# Altium schematic sheet PWR & Sensor Input.SchDoc
size A4
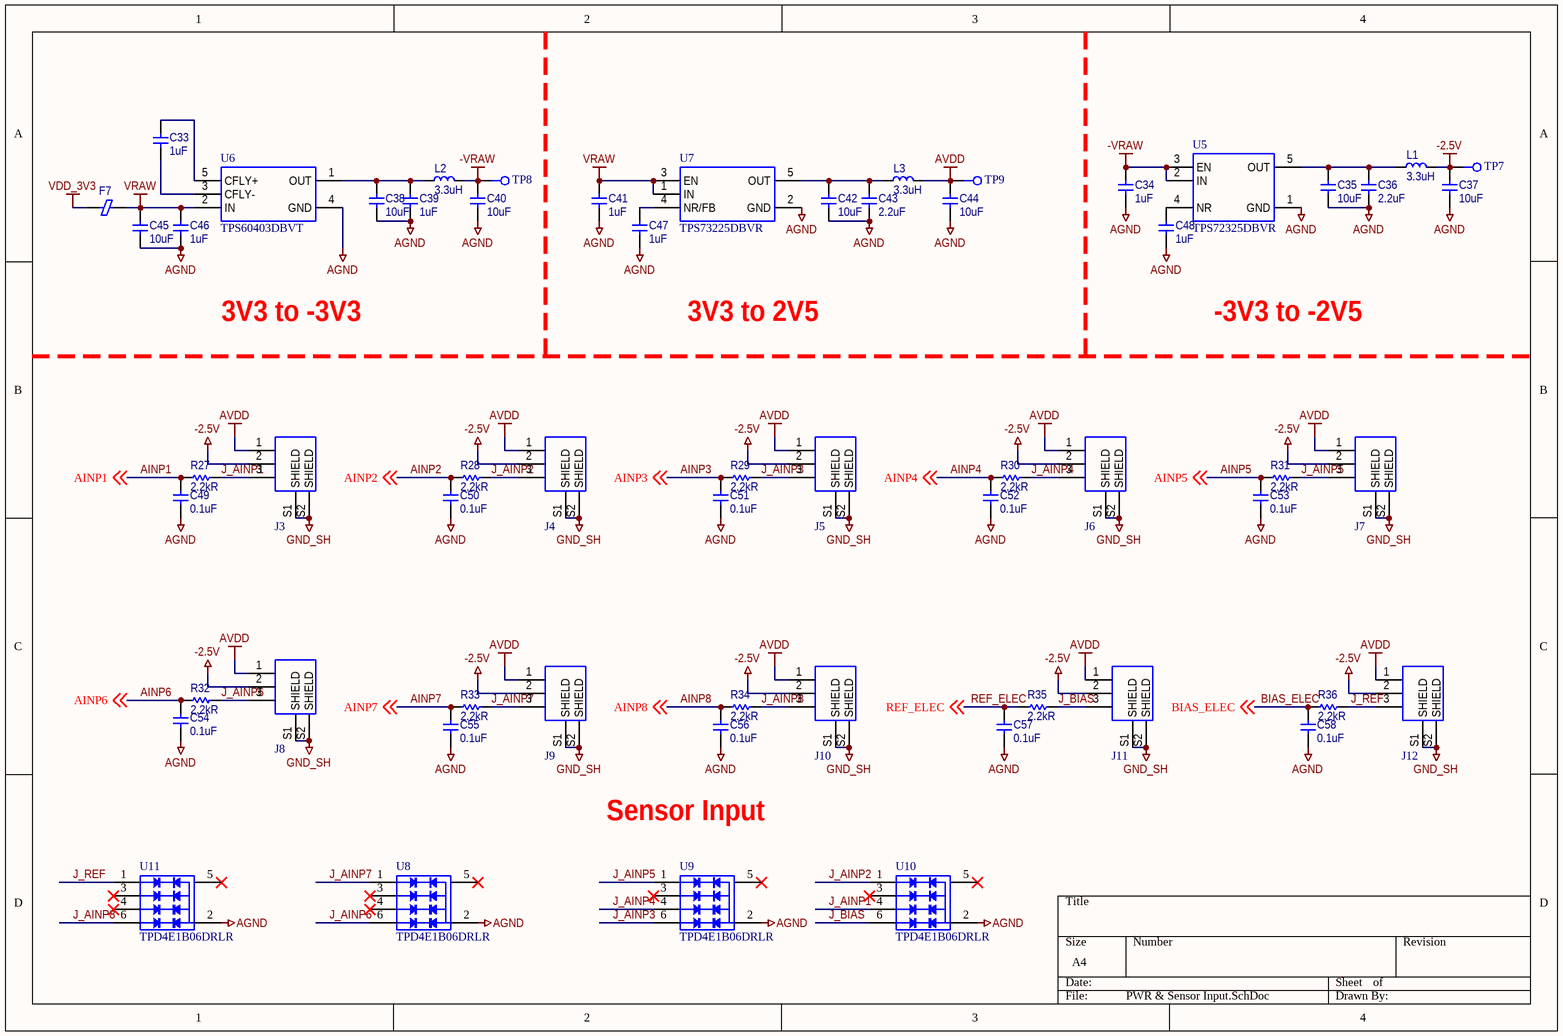
[diagram p0: PWR & Sensor Input.SchDoc]

## Parts
C33  1uF  [C1005X04N]
C34  1uF  [C1005X04N]
C35  10uF  [C1608X06N]
C36  2.2uF  [C1005X04N]
C37  10uF  [C1608X06N]
C38  10uF  [C1608X06N]
C39  1uF  [C1005X04N]
C40  10uF  [C1608X06N]
C41  1uF  [C1005X04N]
C42  10uF  [C1608X06N]
C43  2.2uF  [C1005X04N]
C44  10uF  [C1608X06N]
C45  10uF  [C1608X06N]
C46  1uF  [C1005X04N]
C47  1uF  [C1005X04N]
C48  1uF  [C1005X04N]
C49  0.1uF  [C1005X04N]
C50  0.1uF  [C1005X04N]
C51  0.1uF  [C1005X04N]
C52  0.1uF  [C1005X04N]
C53  0.1uF  [C1005X04N]
C54  0.1uF  [C1005X04N]
C55  0.1uF  [C1005X04N]
C56  0.1uF  [C1005X04N]
C57  0.1uF  [C1005X04N]
C58  0.1uF  [C1005X04N]
F7  120 Ohms @ 100MHz  [F3216X07N]  (value not drawn)
J3  SM03B-SRSS-TB(LF)(SN)  [JST_SM03B-SRSS-TB(LF)(SN)]  (value not drawn)
J4  SM03B-SRSS-TB(LF)(SN)  [JST_SM03B-SRSS-TB(LF)(SN)]  (value not drawn)
J5  SM03B-SRSS-TB(LF)(SN)  [JST_SM03B-SRSS-TB(LF)(SN)]  (value not drawn)
J6  SM03B-SRSS-TB(LF)(SN)  [JST_SM03B-SRSS-TB(LF)(SN)]  (value not drawn)
J7  SM03B-SRSS-TB(LF)(SN)  [JST_SM03B-SRSS-TB(LF)(SN)]  (value not drawn)
J8  SM03B-SRSS-TB(LF)(SN)  [JST_SM03B-SRSS-TB(LF)(SN)]  (value not drawn)
J9  SM03B-SRSS-TB(LF)(SN)  [JST_SM03B-SRSS-TB(LF)(SN)]  (value not drawn)
J10  SM03B-SRSS-TB(LF)(SN)  [JST_SM03B-SRSS-TB(LF)(SN)]  (value not drawn)
J11  SM03B-SRSS-TB(LF)(SN)  [JST_SM03B-SRSS-TB(LF)(SN)]  (value not drawn)
J12  SM03B-SRSS-TB(LF)(SN)  [JST_SM03B-SRSS-TB(LF)(SN)]  (value not drawn)
L1  3.3uH  [L1608X06N]
L2  3.3uH  [L1608X06N]
L3  3.3uH  [L1608X06N]
R27  2.2kR  [R1005X04N]
R28  2.2kR  [R1005X04N]
R29  2.2kR  [R1005X04N]
R30  2.2kR  [R1005X04N]
R31  2.2kR  [R1005X04N]
R32  2.2kR  [R1005X04N]
R33  2.2kR  [R1005X04N]
R34  2.2kR  [R1005X04N]
R35  2.2kR  [R1005X04N]
R36  2.2kR  [R1005X04N]
TP7  TP_25MILC  [TESTPOINT_1MM]  (value not drawn)  (no BOM)
TP8  TP_25MILC  [TESTPOINT_1MM]  (value not drawn)  (no BOM)
TP9  TP_25MILC  [TESTPOINT_1MM]  (value not drawn)  (no BOM)
U5  TPS72325DBVR  [SOT23-5]
U6  TPS60403DBVT  [SOT23-5]
U7  TPS73225DBVR  [SOT23-5]
U8  TPD4E1B06DRLR  [SOT-563]
U9  TPD4E1B06DRLR  [SOT-563]
U10  TPD4E1B06DRLR  [SOT-563]
U11  TPD4E1B06DRLR  [SOT-563]

## Nets
-2.5V: C37.2 J3.2 J4.2 J5.2 J6.2 J7.2 J8.2 J9.2 J10.2 J11.2 J12.2 L1.2 TP7.1
-VRAW: C34.1 C40.2 L2.2 TP8.1 U5.2(IN) U5.3(EN)
AGND: C34.2 C35.1 C36.1 C37.1 C38.1 C39.2 C40.1 C41.2 C42.1 C43.1 C44.1 C45.1 C46.2 C47.2 C48.2 C49.1 C50.1 C51.1 C52.1 C53.1 C54.1 C55.1 C56.1 C57.1 C58.1 U5.1(GND) U6.4(GND) U7.2(GND) U8.2(GND) U9.2(GND) U10.2(GND) U11.2(GND)
AVDD: C44.2 J3.1 J4.1 J5.1 J6.1 J7.1 J8.1 J9.1 J10.1 J11.1 J12.1 L3.2 TP9.1
GND_SH: J3.S1(SHIELD) J3.S2(SHIELD) J4.S1(SHIELD) J4.S2(SHIELD) J5.S1(SHIELD) J5.S2(SHIELD) J6.S1(SHIELD) J6.S2(SHIELD) J7.S1(SHIELD) J7.S2(SHIELD) J8.S1(SHIELD) J8.S2(SHIELD) J9.S1(SHIELD) J9.S2(SHIELD) J10.S1(SHIELD) J10.S2(SHIELD) J11.S1(SHIELD) J11.S2(SHIELD) J12.S1(SHIELD) J12.S2(SHIELD)
VDD_3V3: F7.1
VRAW: C41.1 C45.2 C46.1 F7.2 U6.2(IN) U7.1(IN) U7.3(EN)
AINP1: C49.2 R27.1 ; off-sheet AINP1
AINP2: C50.2 R28.1 ; off-sheet AINP2
AINP3: C51.2 R29.1 ; off-sheet AINP3
AINP4: C52.2 R30.1 ; off-sheet AINP4
AINP5: C53.2 R31.1 ; off-sheet AINP5
AINP6: C54.2 R32.1 ; off-sheet AINP6
AINP7: C55.2 R33.1 ; off-sheet AINP7
AINP8: C56.2 R34.1 ; off-sheet AINP8
BIAS_ELEC: C58.2 R36.1 ; off-sheet BIAS_ELEC
J_AINP1: J3.3 R27.2 U10.4(IO3)
J_AINP2: J4.3 R28.2 U10.1(IO1)
J_AINP3: J5.3 R29.2 U9.6(IO4)
J_AINP4: J6.3 R30.2 U9.4(IO3)
J_AINP5: J7.3 R31.2 U9.1(IO1)
J_AINP6: J8.3 R32.2 U8.6(IO4)
J_AINP7: J9.3 R33.2 U8.1(IO1)
J_AINP8: J10.3 R34.2 U11.6(IO4)
J_BIAS: J11.3 R35.2 U10.6(IO4)
J_REF: J12.3 R36.2 U11.1(IO1)
REF_ELEC: C57.2 R35.1 ; off-sheet REF_ELEC
NetC33_1: C33.1 U6.5(CFLY+)
NetC33_2: C33.2 U6.3(CFLY-)
NetC35_2: C35.2 C36.2 L1.1 U5.5(OUT)
NetC38_2: C38.2 C39.1 L2.1 U6.1(OUT)
NetC42_2: C42.2 C43.2 L3.1 U7.5(OUT)
NetC47_1: C47.1 U7.4(NR/FB)
NetC48_1: C48.1 U5.4(NR)

Not connected (* = marked no-connect by the designer): U8 3(IO2)* 4(IO3)* 5(NC)*; U9 3(IO2)* 5(NC)*; U10 3(IO2)* 5(NC)*; U11 3(IO2)* 4(IO3)* 5(NC)*

## Notes on the sheet
- 3V3 to -3V3
- 3V3 to 2V5
- -3V3 to -2V5
- Sensor Input

## Library data of the parts
C33 C34 C39 C41 C46-C48 = EMK105BJ105KV-F: CAP CER,1UF,10%,16V,X5R,0402,SMD; Manufacturer: Taiyo Yuden; No: 96; Capacitor Type: Ceramic Capacitor; Manufacturer Part Number: EMK105BJ105KV-F; VNPT Part Number: EMK105BJ105KV-F; Capacitance: 1uF; Voltage - Rated: 16V; Tolerance: 10%; Mounting Type: Surface Mount (SMD); Package: 0402; Temperature Coefficient: X5R
C35 C37 C38 C40 C42 C44 C45 = LMK107BBJ106MAHT: CAP CER,10UF,20%,10V,X5R,0603,SMD; Manufacturer: Taiyo Yuden; No: 31; Capacitor Type: Ceramic Capacitor; Manufacturer Part Number: LMK107BBJ106MAHT; VNPT Part Number: LMK107BBJ106MAHT; Capacitance: 10uF; Voltage - Rated: 10V; Tolerance: 20%; Mounting Type: Surface Mount (SMD); Package: 0603; Temperature Coefficient: X5R
C36 C43 = TMK105CBJ225MV-F: CAP CER,2.2UF,20%,25V,X5R,0402,SMD; Manufacturer: Taiyo Yuden; No: 140; Capacitor Type: Ceramic Capacitor; Manufacturer Part Number: TMK105CBJ225MV-F; VNPT Part Number: TMK105CBJ225MV-F; Capacitance: 2.2uF; Voltage - Rated: 25V; Tolerance: 20%; Mounting Type: Surface Mount (SMD); Package: 0402; Temperature Coefficient: X5R
C49-C58 = TMK105BJ104MV-F: CAP CER,0.1UF,20%,25V,X5R,0402,SMD; Manufacturer: Taiyo Yuden; No: 79; Capacitor Type: Ceramic Capacitor; Manufacturer Part Number: TMK105BJ104MV-F; VNPT Part Number: TMK105BJ104MV-F; Capacitance: 0.1uF; Voltage - Rated: 25V; Tolerance: 20%; Mounting Type: Surface Mount (SMD); Package: 0402; Temperature Coefficient: X5R
F7 = BLM31KN271BH1L: FERRITE BEAD,120 OHMS @ 100MHZ,0.0016R,3A,1206,SMD; Manufacturer: Murata Electronics; No: 10; Manufacturer Part Number: BLM31KN271BH1L; VNPT Part Number: BLM31KN271BH1L; Impedance: 120 Ohms @ 100MHz; DC Resistance (DCR): 0.0016R; Current Rating: 3A; Mounting Type: Surface Mount (SMD); Package: 1206
J3-J12 = SM03B-SRSS-TB(LF)(SN): CONN HEADER SMD R/A 3POS 1MM; Manufacturer: JST Sales America Inc.; Manufacturer Part Number: SM03B-SRSS-TB(LF)(SN)
L1-L3 = MLZ1608N3R3LT000: IND,3.3UH,20%,450MA,0.027R,0603,SMD; Manufacturer: TDK Corporation; No: 27; Inductor Type: Multilayer; Manufacturer Part Number: MLZ1608N3R3LT000; VNPT Part Number: MLZ1608N3R3LT000; Inductance: 3.3uH; Tolerance: 20%; Current Rating: 450mA; DC Resistance (DCR): 0.027R; Mounting Type: Surface Mount (SMD); Package: 0603
R27-R36 = RC0402FR-072K2L: RES,2.2KR,1%,62.5MW,0402,SMD; Manufacturer: Yageo; No: 109; Manufacturer Part Number: RC0402FR-072K2L; VNPT Part Number: RC0402FR-072K2L; Resistance: 2.2kR; Tolerance: 1%; Power: 62.5mW; Resistor Type: Genneral Purpose Resistor; Mounting Type: Surface Mount (SMD); Package: 0402
TP7-TP9 = TP_25MILC: Test Point 25mil
U5 = TPS72325DBVR: IC REG LIN -2.5V 200MA SOT23-5; Manufacturer: Texas Instruments; Manufacturer Part Number: TPS72325DBVR
U6 = TPS60403DBVT: TPS60403 60MA CHARGE PUMP VOLTAG; Manufacturer: Texas Instruments; Manufacturer Part Number: TPS60403DBVT
U7 = TPS73225DBVR: IC REG LINEAR 2.5V 250MA SOT23-5; Manufacturer: Texas Instruments; Manufacturer Part Number: TPS73225DBVR
U8-U11 = TPD4E1B06DRLR: TVS DIODE 5.5VWM 14.5VC 6SOT; Manufacturer: Texas Instruments; Manufacturer Part Number: TPD4E1B06DRLR